# EAGLE design x-OSC Gloves_v4_2 (EAGLE 6.5.0)
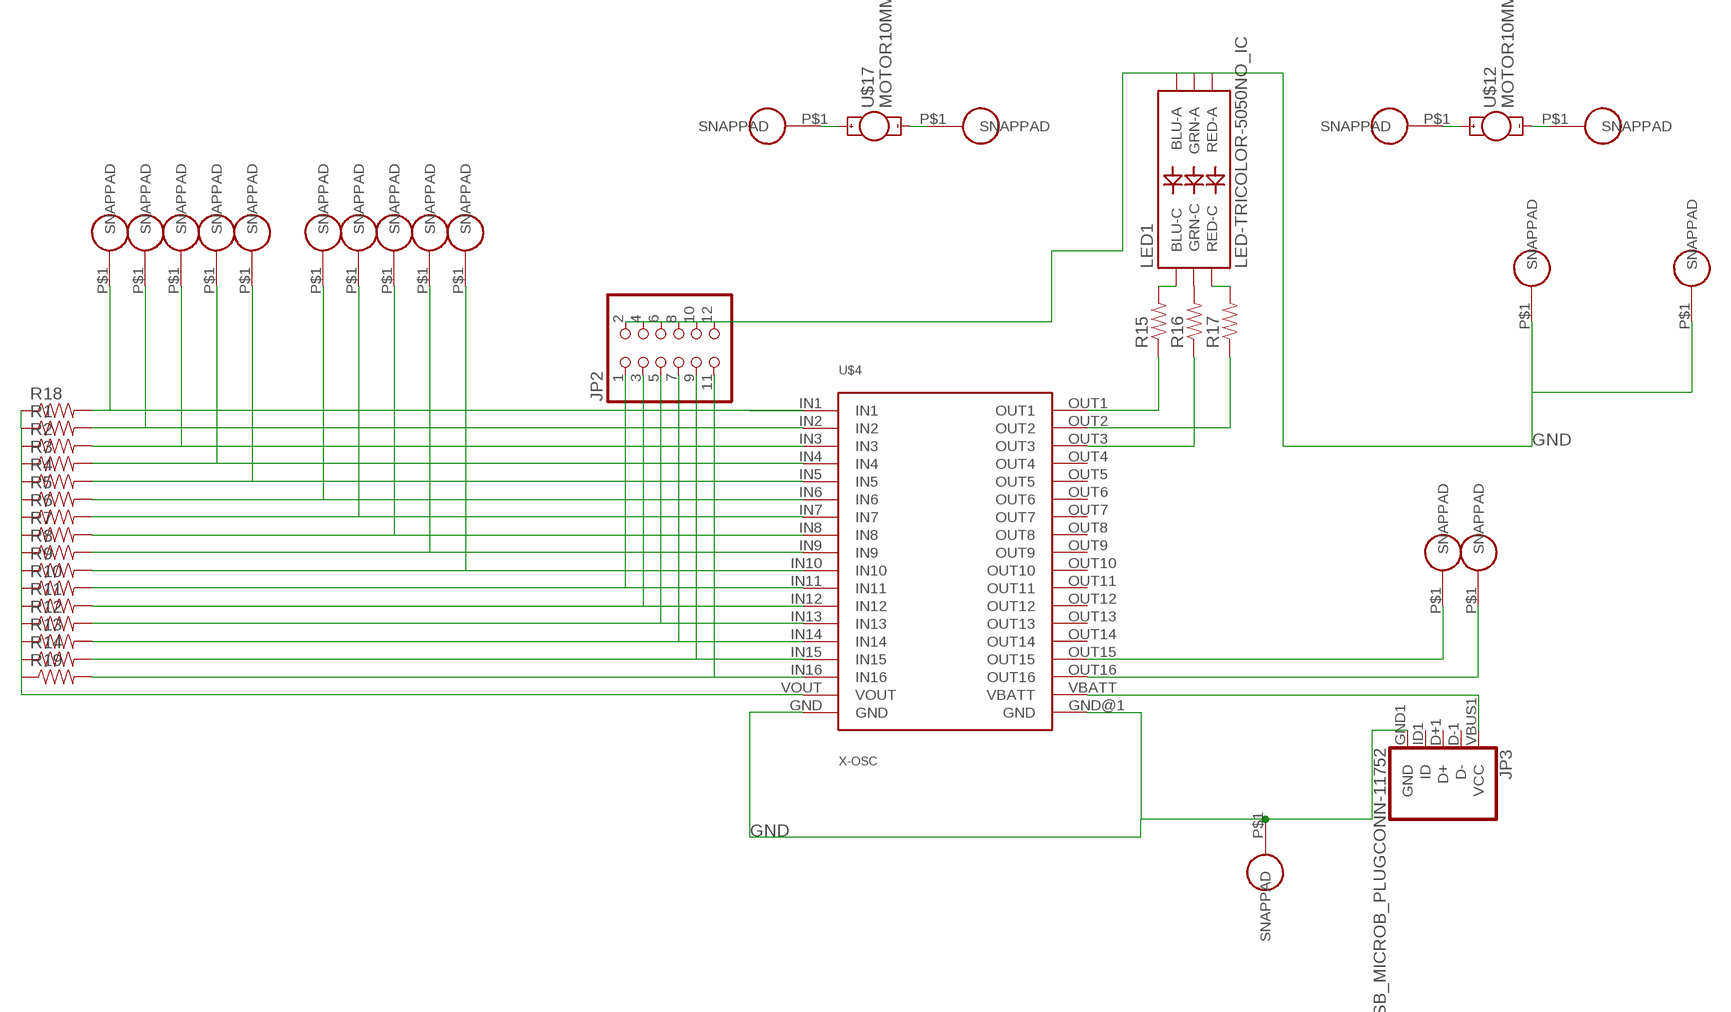
[diagram p0: schematic, sheet 1]

## Parts
JP2  PINHD-2X6/90  [2X06/90]
JP3  USB_MICROB_PLUGCONN-11752  [USB-B-MICRO-SMD_V03]
LED1  LED-TRICOLOR-5050NO_IC  [LED-TRICOLOR-5050]
R1  RESISTOR0805-RES  [0805]
R2  RESISTOR0805-RES  [0805]
R3  RESISTOR0805-RES  [0805]
R4  RESISTOR0805-RES  [0805]
R5  RESISTOR0805-RES  [0805]
R6  RESISTOR0805-RES  [0805]
R7  RESISTOR0805-RES  [0805]
R8  RESISTOR0805-RES  [0805]
R9  RESISTOR0805-RES  [0805]
R10  RESISTOR0805-RES  [0805]
R11  RESISTOR0805-RES  [0805]
R12  RESISTOR0805-RES  [0805]
R13  RESISTOR0805-RES  [0805]
R14  RESISTOR0805-RES  [0805]
R15  RESISTOR0805-RES  [0805]
R16  RESISTOR0805-RES  [0805]
R17  RESISTOR0805-RES  [0805]
R18  RESISTOR0805-RES  [0805]
R19  RESISTOR0805-RES  [0805]
U$1  SNAP-PAD_7MM_ROUND  [SNAP-PAD_7MM_RD]
U$2  SNAP-PAD_7MM_ROUND  [SNAP-PAD_7MM_RD]
U$3  SNAP-PAD_7MM_ROUND  [SNAP-PAD_7MM_RD]
U$4  X-OSC  [X-OSC_SMD]
U$6  SNAP-PAD_7MM_ROUND  [SNAP-PAD_7MM_RD]
U$7  SNAP-PAD_7MM_ROUND  [SNAP-PAD_7MM_RD]
U$8  SNAP-PAD_7MM_ROUND  [SNAP-PAD_7MM_RD]
U$9  SNAP-PAD_7MM_ROUND  [SNAP-PAD_7MM_RD]
U$10  SNAP-PAD_7MM_ROUND  [SNAP-PAD_7MM_RD]
U$11  SNAP-PAD_7MM_ROUND  [SNAP-PAD_7MM_RD]
U$12  MOTOR10MM  [VIBE-MOTOR-10MM]
U$13  SNAP-PAD_7MM_ROUND  [SNAP-PAD_7MM_RD]
U$14  SNAP-PAD_7MM_ROUND  [SNAP-PAD_7MM_RD]
U$15  SNAP-PAD_7MM_ROUND  [SNAP-PAD_7MM_RD]
U$16  SNAP-PAD_7MM_ROUND  [SNAP-PAD_7MM_RD]
U$17  MOTOR10MM  [VIBE-MOTOR-10MM]
U$18  SNAP-PAD_7MM_ROUND  [SNAP-PAD_7MM_RD]
U$19  SNAP-PAD_7MM_ROUND  [SNAP-PAD_7MM_RD]
U$20  SNAP-PAD_7MM_ROUND  [SNAP-PAD_7MM_RD]
U$21  SNAP-PAD_7MM_ROUND  [SNAP-PAD_7MM_RD]
U$22  SNAP-PAD_7MM_ROUND  [SNAP-PAD_7MM_RD]
U$23  SNAP-PAD_7MM_ROUND  [SNAP-PAD_7MM_RD]

## Nets
GND: JP2.2 JP2.4 JP2.6 JP2.8 JP2.10 JP2.12 JP3.GND1(GND) LED1.1(GRN-A) LED1.2(RED-A) LED1.3(BLU-A) U$4.GND U$4.GND@1(GND) U$15.P$1(SNAPPAD) U$16.P$1(SNAPPAD) U$18.P$1(SNAPPAD)
N$1: LED1.6(GRN-C) R16.2
N$2: LED1.4(BLU-C) R15.2
N$3: R16.1 U$4.OUT3
N$4: R1.2 U$1.P$1(SNAPPAD) U$4.IN2
N$6: R2.2 U$2.P$1(SNAPPAD) U$4.IN3
N$7: R3.2 U$3.P$1(SNAPPAD) U$4.IN4
N$8: R4.2 U$4.IN5 U$6.P$1(SNAPPAD)
N$9: R5.2 U$4.IN6 U$7.P$1(SNAPPAD)
N$12: R6.2 U$4.IN7 U$8.P$1(SNAPPAD)
N$13: R7.2 U$4.IN8 U$9.P$1(SNAPPAD)
N$14: R8.2 U$4.IN9 U$10.P$1(SNAPPAD)
N$15: R9.2 U$4.IN10 U$11.P$1(SNAPPAD)
N$16: JP2.1 R10.2 U$4.IN11
N$17: LED1.5(RED-C) R17.2
N$18: JP2.3 R11.2 U$4.IN12
N$19: JP2.5 R12.2 U$4.IN13
N$20: JP2.7 R13.2 U$4.IN14
N$21: JP2.9 R14.2 U$4.IN15
N$22: JP2.11 R19.2 U$4.IN16
N$23: U$4.OUT15 U$13.P$1(SNAPPAD)
N$24: U$4.OUT16 U$14.P$1(SNAPPAD)
N$25: R17.1 U$4.OUT2
N$26: R15.1 U$4.OUT1
N$29: U$12.+ U$22.P$1(SNAPPAD)
N$30: U$12.- U$23.P$1(SNAPPAD)
N$33: JP3.VBUS1(VCC) U$4.VBATT
N$38: U$17.+ U$19.P$1(SNAPPAD)
N$40: R18.2 U$4.IN1 U$21.P$1(SNAPPAD)
N$46: U$17.- U$20.P$1(SNAPPAD)
N$58: R1.1 R2.1 R3.1 R4.1 R5.1 R6.1 R7.1 R8.1 R9.1 R10.1 R11.1 R12.1 R13.1 R14.1 R18.1 R19.1 U$4.VOUT
Unconnected: JP3.D+1(D+) JP3.D-1(D-) JP3.ID1(ID) U$4.OUT4 U$4.OUT5 U$4.OUT6 U$4.OUT7 U$4.OUT8 U$4.OUT9 U$4.OUT10 U$4.OUT11 U$4.OUT12 U$4.OUT13 U$4.OUT14

## Library data of the parts
JP2 = pinhead:PINHD-2X6: PIN HEADER
JP3 = SparkFun-Connectors:USB_MICROB_PLUG: USB Micro-B Plug Comes in a variety of packages. Check out Hirose's ZX-x0 line: http://www.hirose.co.jp/cataloge_hp/e24200011.pdf; PROD_ID: CONN-11752
LED1 = SparkFun-LED:LED-TRICOLOR-5050
R1-R19 = SparkFun-Passives:RESISTOR: Resistor Basic schematic elements and footprints for 0603, 1206, and PTH resistors.
U$1-U$3 U$6-U$11 U$13-U$16 U$18-U$23 = hannahsEagleLib:SNAP-PAD_7MM_ROUND
U$4 = x-io:X-OSC: 2x "TSM-118-04-F-SV" See: http://www.toby.co.uk/content/catalogue/products.aspx?series=TSM-1xx-xx-SV
U$12 U$17 = SparkFun-Electromechanical:MOTOR: Vibration Motor- ROB-08449 Physical dimension and wire connections for this powerful vibration motor. Motor has a self adhesive backing.

## Board
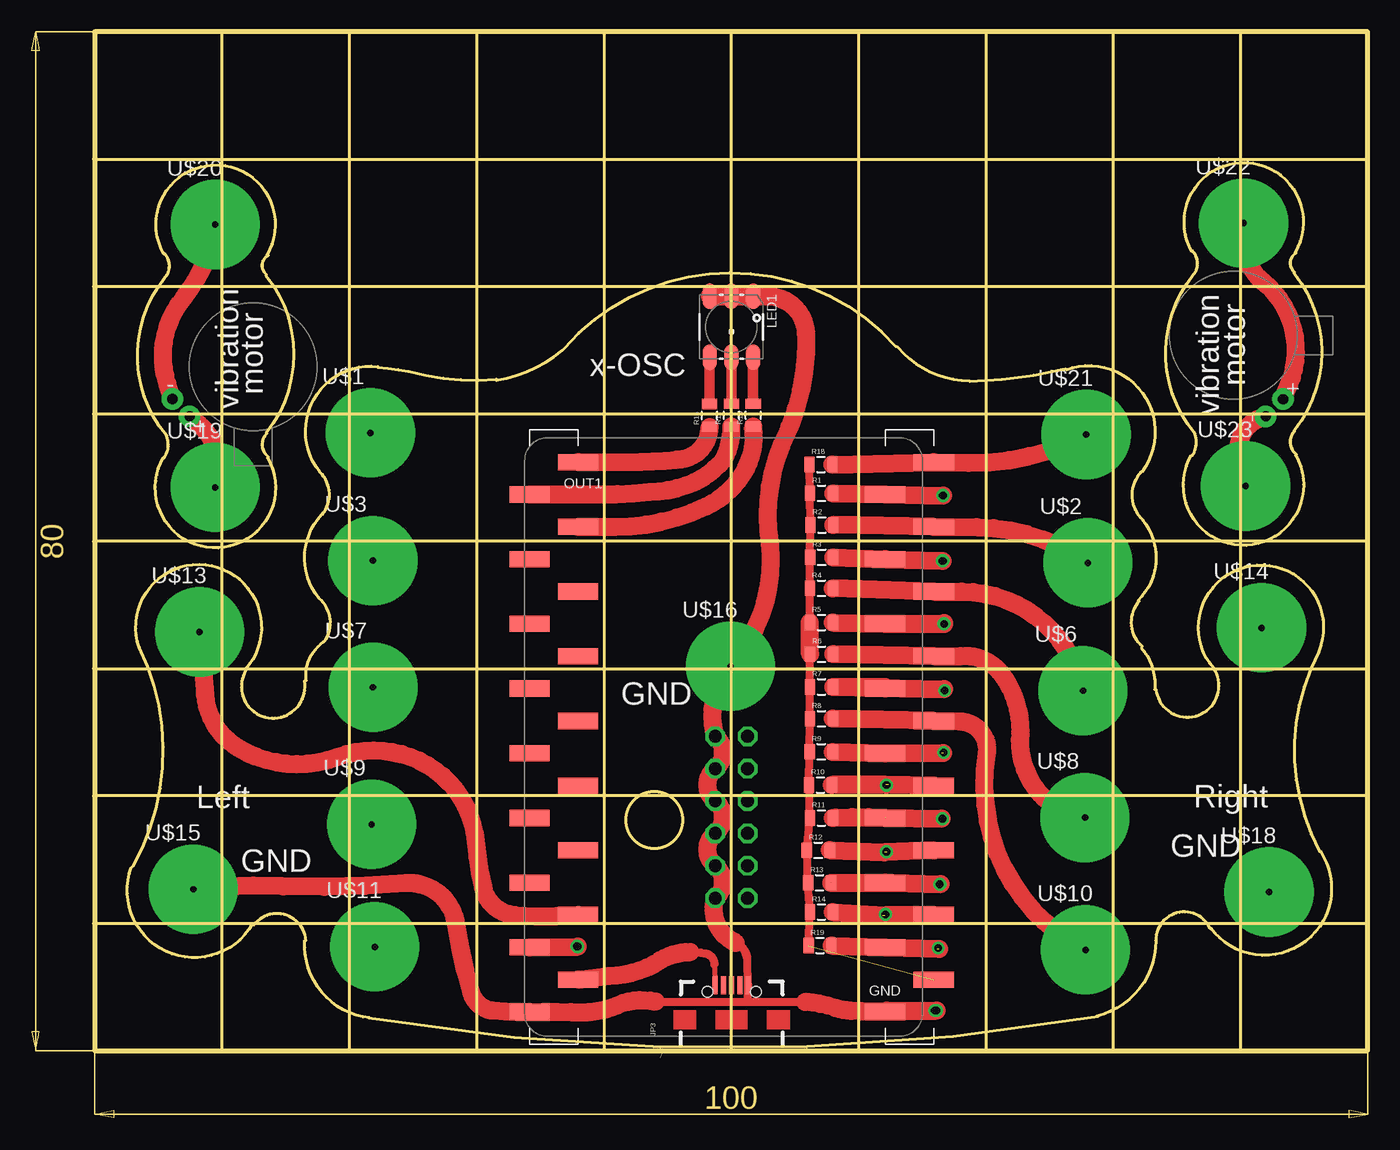
[diagram p1: board, top side]
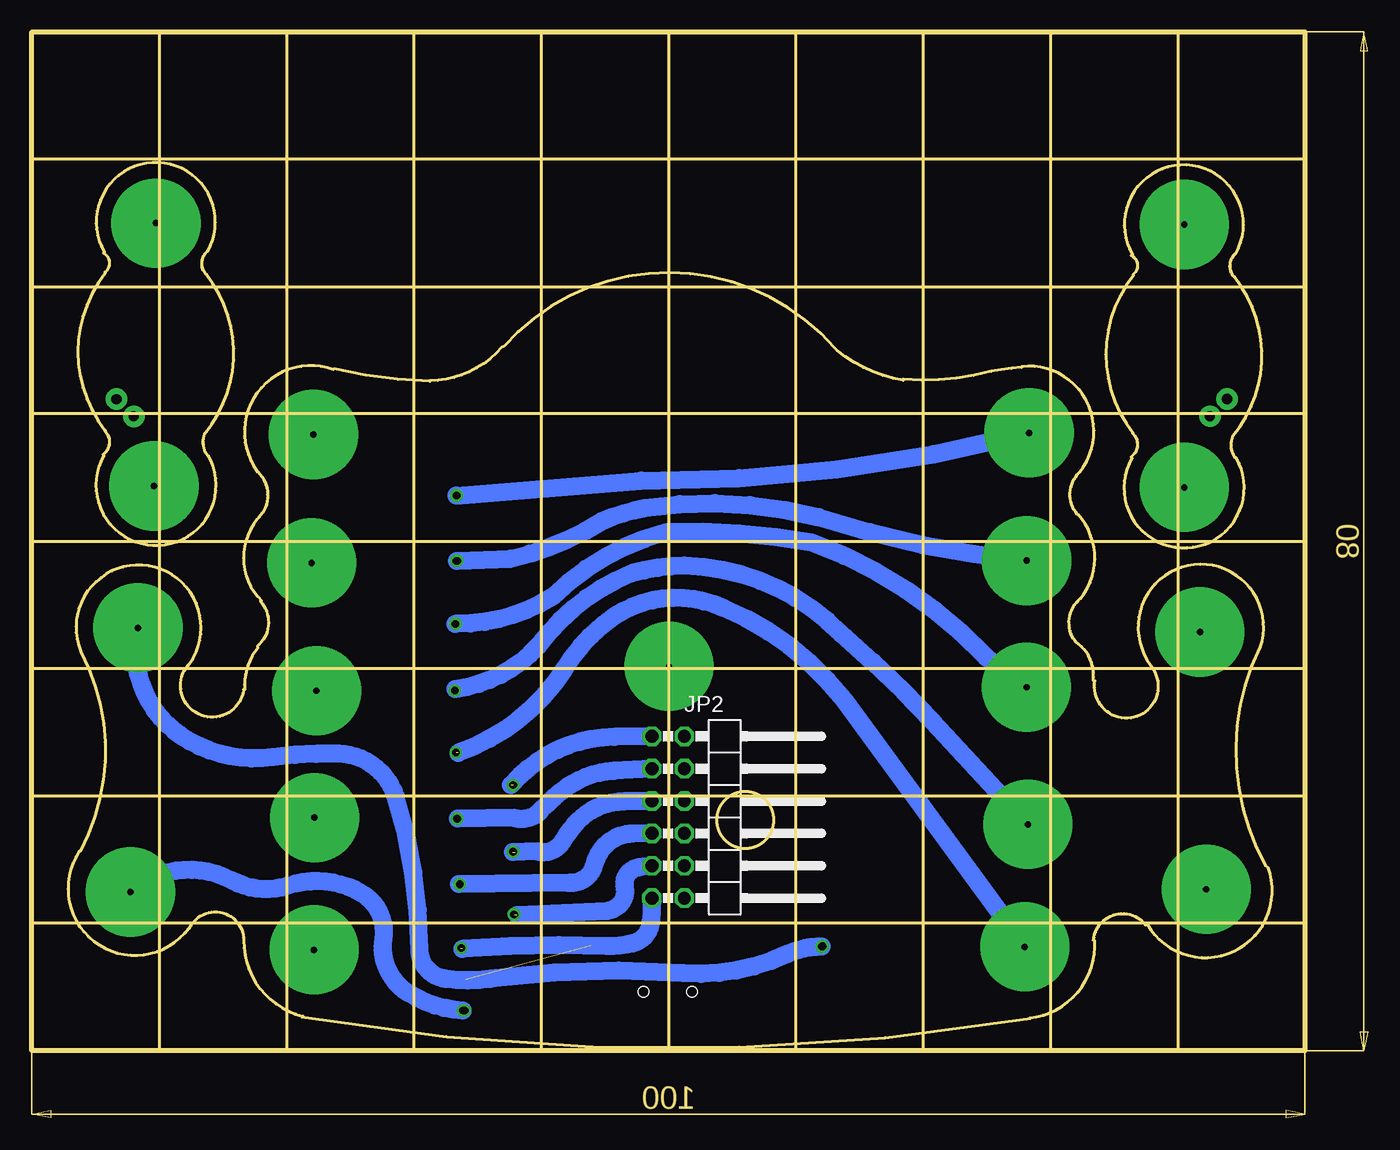
[diagram p2: board, bottom side, seen from below]

Size 100 x 80 mm. Coordinates in mm from the lower left corner, seen from the top.
Outline: 10,0 0,0 0,10
Outline: 10,0 20,0
Outline: 20,0 30,0
Outline: 30,0 40,0
Outline: 40,0 50,0
Outline: 50,0 60,0
Outline: 60,0 70,0
Outline: 70,0 80,0
Outline: 80,0 90,0
Outline: 90,0 100,0 100,10
Outline: 100,10 100,20
Outline: 100,20 100,30
Outline: 100,30 100,40
Outline: 100,40 100,50
Outline: 100,50 100,60
Outline: 100,60 100,70
Outline: 100,70 100,80 90,80
Outline: 90,80 80,80
Outline: 80,80 70,80
Outline: 70,80 60,80
Outline: 60,80 50,80
Outline: 50,80 40,80
Outline: 40,80 30,80
Outline: 30,80 20,80
Outline: 20,80 10,80
Outline: 10,80 0,80 0,70
Outline: 0,70 0,60
Outline: 0,60 0,50
Outline: 0,50 0,40
Outline: 0,40 0,30
Outline: 0,30 0,20
Outline: 0,20 0,10
Outline: 0,10 100,10
Outline: 100,20 0,20
Outline: 0,30 100,30
Outline: 100,40 0,40
Outline: 0,50 100,50
Outline: 100,60 0,60
Outline: 0,70 100,70
Outline: 10,80 10,0
Outline: 20,80 20,0
Outline: 30,80 30,0
Outline: 40,80 40,0
Outline: 50,80 50,0
Outline: 60,80 60,0
Outline: 70,80 70,0
Outline: 80,80 80,0
Outline: 90,80 90,0
Copper layers (1*16): Top 0.035mm / dielectric 1.5mm / Bottom 0.035mm
Design rules "default": minimum track width 10mil, minimum drill 24mil, track to track 8mil, track to pad 8mil, pad to pad 8mil, via to via 8mil, smd to smd 8mil, copper to edge 40mil, drill to drill 8mil, minimum pad ring 10mil, minimum via ring 8mil, stop-mask expansion 4mil, vias tented up to drill 0mil, thermal gap 10mil
Milling: area 41.7,15.9 to 46.2,20.3; 45 lines

### Footprints (pad centres in the part's own frame; a part is rotated, then mirrored left to right if it is on the bottom)
2X06/90 = drill 1.016 octagon: 1 -6.35,-6.35; 2 -6.35,-3.81; 3 -3.81,-6.35; 4 -3.81,-3.81; 5 -1.27,-6.35; 6 -1.27,-3.81; 7 1.27,-6.35; 8 1.27,-3.81; 9 3.81,-6.35; 10 3.81,-3.81; 11 6.35,-6.35; 12 6.35,-3.81
USB-B-MICRO-SMD_V03 = smd 1.4 x 0.4: D+1 2.7,0; D-1 2.7,0.65; GND1 2.7,-1.3; ID1 2.7,-0.65; VBUS1 2.7,1.3 | hole 0.85: 2.2,1.9; 2.2,-1.9
LED-TRICOLOR-5050 = smd 2 x 1.1: 1 -2.4,1.7; 2 -2.4,0; 3 -2.4,-1.7; 4 2.4,-1.7; 5 2.4,0; 6 2.4,1.7
0805 = smd 0.8 x 1.2: 1 -0.9,0; 2 0.9,0
SNAP-PAD_7MM_RD = drill 0.5 pad 7: P$1 0,0
X-OSC_SMD = smd 3.17 x 1.27: GND 12.7,-21.59; GND@1 -15.24,-21.59; IN1 16.51,21.59; IN2 12.7,19.05; IN3 16.51,16.51; IN4 12.7,13.97; IN5 16.51,11.43; IN6 12.7,8.89; IN7 16.51,6.35; IN8 12.7,3.81; IN9 16.51,1.27; IN10 12.7,-1.27; IN11 16.51,-3.81; IN12 12.7,-6.35; IN13 16.51,-8.89; IN14 12.7,-11.43; IN15 16.51,-13.97; IN16 12.7,-16.51; OUT1 -11.43,21.59; OUT2 -15.24,19.05; OUT3 -11.43,16.51; OUT4 -15.24,13.97; OUT5 -11.43,11.43; OUT6 -15.24,8.89; OUT7 -11.43,6.35; OUT8 -15.24,3.81; OUT9 -11.43,1.27; OUT10 -15.24,-1.27; OUT11 -11.43,-3.81; OUT12 -15.24,-6.35; OUT13 -11.43,-8.89; OUT14 -15.24,-11.43; OUT15 -11.43,-13.97; OUT16 -15.24,-16.51; VBATT -11.43,-19.05; VOUT 16.51,-19.05
VIBE-MOTOR-10MM = drill 0.8 pad 1.676: + -5,-3.9; - -6.35,-2.54

### Placement (x,y rotation side)
JP2  44.94,18.33 270 bottom
JP3  50.04,2.43 90 top
LED1  50.02,56.84 270 top
R1  57.1,43.76 0 top
R2  57.13,41.28 0 top
R3  57.11,38.74 0 top
R4  57.09,36.31 0 top
R5  57.09,33.62 0 top
R6  57.1,31.13 0 top
R7  57.1,28.57 0 top
R8  57.09,26.06 0 top
R9  57.07,23.46 0 top
R10  57.02,20.86 0 top
R11  57.09,18.27 0 top
R12  56.84,15.74 0 top
R13  56.95,13.18 0 top
R14  57.09,10.88 0 top
R15  48.3,49.88 90 top
R16  51.73,49.91 90 top
R17  50.02,49.9 90 top
R18  57.05,46.02 0 top
R19  56.99,8.25 0 top
U$1  21.66,48.51 0 top
U$2  78.02,38.31 0 top
U$3  21.85,38.48 0 top
U$4  49.41,24.62 0 top
U$6  77.63,28.27 0 top
U$7  21.87,28.53 0 top
U$8  77.8,18.29 0 top
U$9  21.76,17.77 0 top
U$10  77.83,7.91 0 top
U$11  22,8.15 0 top
U$12  89.45,56.16 90 top
U$13  8.25,32.88 0 top
U$14  91.67,33.2 0 top
U$15  7.75,12.68 0 top
U$16  49.95,30.18 0 top
U$17  12.46,53.71 0 top
U$18  92.25,12.46 0 top
U$19  9.47,44.23 0 top
U$20  9.47,64.87 0 top
U$21  77.88,48.38 0 top
U$22  90.25,64.98 0 top
U$23  90.41,44.34 0 top

### Tracks (layer width: path | path; a pad name or v marks a point on that pad's centre or on a via)
GND  (via drill 0.6)
  Top 0.406: 62.23,3.15 arc90 U$4.GND arc-90 62.09,3.01
  Top 0.61: 50.38,8.46 arc-66 51.28,7.1 JP3.GND1 51.29,5.34 51.29,3.85 | 44.07,3.85 51.29,3.85 | 51.29,3.85 55.81,3.84
  Top 0.813: 62.09,3.01 arc90 62.04,3.06
  Top 1.422: LED1.3 LED1.2 | LED1.2 LED1.1 | LED1.2 52.89,59.25 arc-87 55.87,56.33 arc-29 53.96,47.59 arc32 53.05,39.74 arc-47 U$16.P$1 arc58 JP2.2 arc-105 JP2.4 arc105 JP2.6 arc-105 JP2.8 arc105 JP2.10 arc-105 JP2.12 arc83 50.38,8.46 | U$15.P$1 arc-9 14.83,12.91 arc7 24.45,13.16 arc-86 28.43,9.81 arc9 29.61,4.51 arc68 31.29,3.14 arc6 U$4.GND@1 arc-2 37.42,3.03 arc18 40.17,3.25 arc8 41.48,3.75 arc-28 44.07,3.85 | 62.23,3.15 v66.13,3.15 | 62.04,3.06 arc-3 59.43,3.13 arc-15 58.18,3.36 arc13 55.81,3.84
  Bottom 1.422: v66.13,3.15 arc29 70.41,4.51 arc67 72.38,8.79 arc-68 74.07,12.34 arc-49 79.87,12.96 arc47 84.26,13.35 arc-70 U$18.P$1
N$1
  Top 0.813: LED1.6 R16.2
N$2
  Top 0.813: R15.2 LED1.4
N$3
  Top 1.422: U$4.OUT3 40.85,41.13 arc25 48.03,42.73 arc33 50.93,45.29 arc40 R16.1
N$4  (via drill 0.6)
  Top 1.422: v66.66,43.58 U$4.IN2 R1.2
  Bottom 1.422: v66.66,43.58 52.13,44.76 arc-15 U$1.P$1
N$5  (via drill 0.6)
  other vias: 66.6,18.21
N$6
  Top 1.422: U$2.P$1 arc34 69.29,41.1 U$4.IN3 R2.2
N$7  (via drill 0.6)
  Top 1.422: v66.6,38.46 U$4.IN4 R3.2
  Bottom 1.422: v66.6,38.46 62.37,38.63 arc-20 55.24,41.58 arc12 51.82,42.62 arc23 38.18,41.89 arc-12 U$3.P$1
N$8
  Top 1.422: U$6.P$1 arc78 68.11,36.05 U$4.IN5 R4.2
N$9  (1 unrouted)
  Top 1.422: 66.72,33.57 66.72,33.51 U$4.IN6 R5.2
  Bottom 1.422: U$7.P$1 25.02,30.88 arc-27 38.73,39.89 arc-12 50.19,40.7 arc-30 59.09,35.65 arc33 66.72,33.51
N$12
  Top 1.422: U$8.P$1 arc-88 72.71,24.97 arc37 71.28,29.52 arc60 68.04,30.98 U$4.IN7 R6.2
N$13  (1 unrouted)
  Top 1.422: U$4.IN8 62.11,28.57 R7.2 66.72,28.39
  Bottom 1.422: U$9.P$1 29.21,25.81 arc-7 36.41,32.73 arc-43 48.74,38.09 arc-13 52.91,37.47 arc-32 60.23,31.78 arc40 66.72,28.39
N$14
  Top 1.422: U$10.P$1 arc-73 70.07,23.28 arc99 67.92,25.86 U$4.IN9 R8.2
N$15  (1 unrouted)
  Top 1.422: 66.67,23.38 U$4.IN10 R9.2
  Bottom 1.422: U$11.P$1 36.18,27.52 arc-29 45.67,34.75 arc-58 54.27,34.1 arc-24 58.24,29.88 arc37 66.51,23.38
N$16  (1 unrouted)
  Top 1.422: U$4.IN11 62.17,20.87 arc2 R10.2
  Bottom 1.422: JP2.1 54.24,24.64 arc-48 62.36,20.87
N$17
  Top 0.813: R17.2 LED1.5
N$18  (1 unrouted)
  Top 1.422: 66.53,18.22 U$4.IN12 arc8 58.21,18.29 R11.2
  Bottom 1.422: JP2.3 54.29,21.97 arc-37 58.46,20.32 arc-7 60.06,18.82 arc63 U$4.IN12 66.53,18.22
N$19  (1 unrouted)
  Top 1.422: U$4.IN13 62.04,15.58 R12.2
  Bottom 1.422: JP2.5 53.49,19.57 arc-49 57.38,17.74 arc-10 58.32,16.43 arc75 60.3,15.64 62.23,15.59
N$20  (1 unrouted)
  Top 1.422: U$4.IN14 62.62,13.18 | 62.62,13.18 66.46,13.07 | R13.2 62.62,13.18
  Bottom 1.422: JP2.7 52.78,17.04 arc-76 55.83,14.6 arc83 R13.2 66.46,13.07
N$21  (1 unrouted)
  Top 1.422: U$4.IN15 62.1,10.63 R14.2
  Bottom 1.422: JP2.9 52.33,14.39 arc-95 53.43,12.84 arc60 53.89,11.41 arc33 54.81,10.96 61.88,10.64
N$22  (1 unrouted)
  Top 1.422: 66.33,7.99 U$4.IN16 R19.2
  Bottom 1.422: JP2.11 51.37,10.18 arc73 52.79,8.43 arc17 54.85,8.21 arc-7 66.17,8
N$23
  Top 1.422: U$13.P$1 8.68,27.93 arc54 11.27,23.79 arc51 19.06,23.06 arc-40 24.82,23.06 arc-65 29.93,16.4 arc8 30.5,12.83 arc40 31.55,11.2 arc33 33.01,10.64 arc9 U$4.OUT15
N$24  (via drill 0.6)
  Top 1.422: U$4.OUT16 v37.96,8.17
  Bottom 1.422: v37.96,8.17 arc-26 40.61,7.6 arc29 48.83,6.08 arc-12 63.99,5.63 arc15 67.48,5.63 arc82 69.56,8 arc-17 71.42,19.94 arc-71 75.93,23.32 arc-9 81.05,23.04 arc37 87.59,24.28 arc73 U$14.P$1
N$25
  Top 1.422: U$4.OUT2 39.78,43.68 arc6 43.6,43.87 arc27 47.76,44.97 arc16 49.4,46.39 arc31 R17.1
N$26
  Top 1.422: U$4.OUT1 42.92,46.24 arc6 45.74,46.41 arc90 R15.1
N$29
  Top 1.422: U$12.+ 93.82,52.27 arc74 91.73,60.42 arc-62 U$22.P$1
N$30
  Top 1.422: U$23.P$1 89.91,46.55 arc-91 U$12.-
N$31  (via drill 0.6)
  other vias: 66.63,43.6
N$32  (via drill 0.6)
  other vias: 66.63,38.46
N$33
  Top 0.406: 48.69,6.76 JP3.VBUS1
  Top 0.61: 46.8,7.74 arc-14 47.87,7.64 arc-90 48.69,6.76
  Top 1.422: U$4.VBATT 40.4,5.87 arc32 44.45,7.11 arc-31 46.8,7.74
N$38
  Top 1.422: U$17.+ 8.19,49.19 arc-70 U$19.P$1
N$40
  Top 1.422: U$21.P$1 arc-29 68.65,46.16 U$4.IN1 R18.2
N$46
  Top 1.422: U$17.- 5.72,52.38 arc-57 6.98,59.1 arc31 U$20.P$1
N$47  (via drill 0.6)
  other vias: 62.2,20.85
N$48  (via drill 0.6)
  other vias: 66.72,33.51
N$49  (via drill 0.6)
  other vias: 66.77,28.28
N$50  (via drill 0.6)
  other vias: 66.7,23.41
N$51  (via drill 0.6)
  other vias: 62.2,15.62
N$52  (via drill 0.6)
  other vias: 62.12,10.7
N$53  (via drill 0.6)
  other vias: 66.39,13.07
N$54  (via drill 0.6)
  other vias: 66.26,8.06
N$55  (via drill 0.6)
  other vias: 66.01,3.15
N$56  (via drill 0.6)
  other vias: 37.89,8.2
N$58  (1 unrouted)
  Top 0.61: R19.1 R14.1 R13.1 R12.1 R11.1 R10.1 R9.1 R8.1 R7.1 R6.1 | R5.1 R4.1 R3.1 R2.1 R1.1 R18.1
  Top 1.422: R6.1 R5.1

### Text on the board
_tsilk: x-OSC | motor | motor | vibration | vibration | GND | Left | Right | GND | GND
200bmp: C:/Users/Perner/Desktop/HannahStuff/Gloves_x-OSC_ltBMP8004.bmp